# EAGLE design headset (EAGLE 6.4)
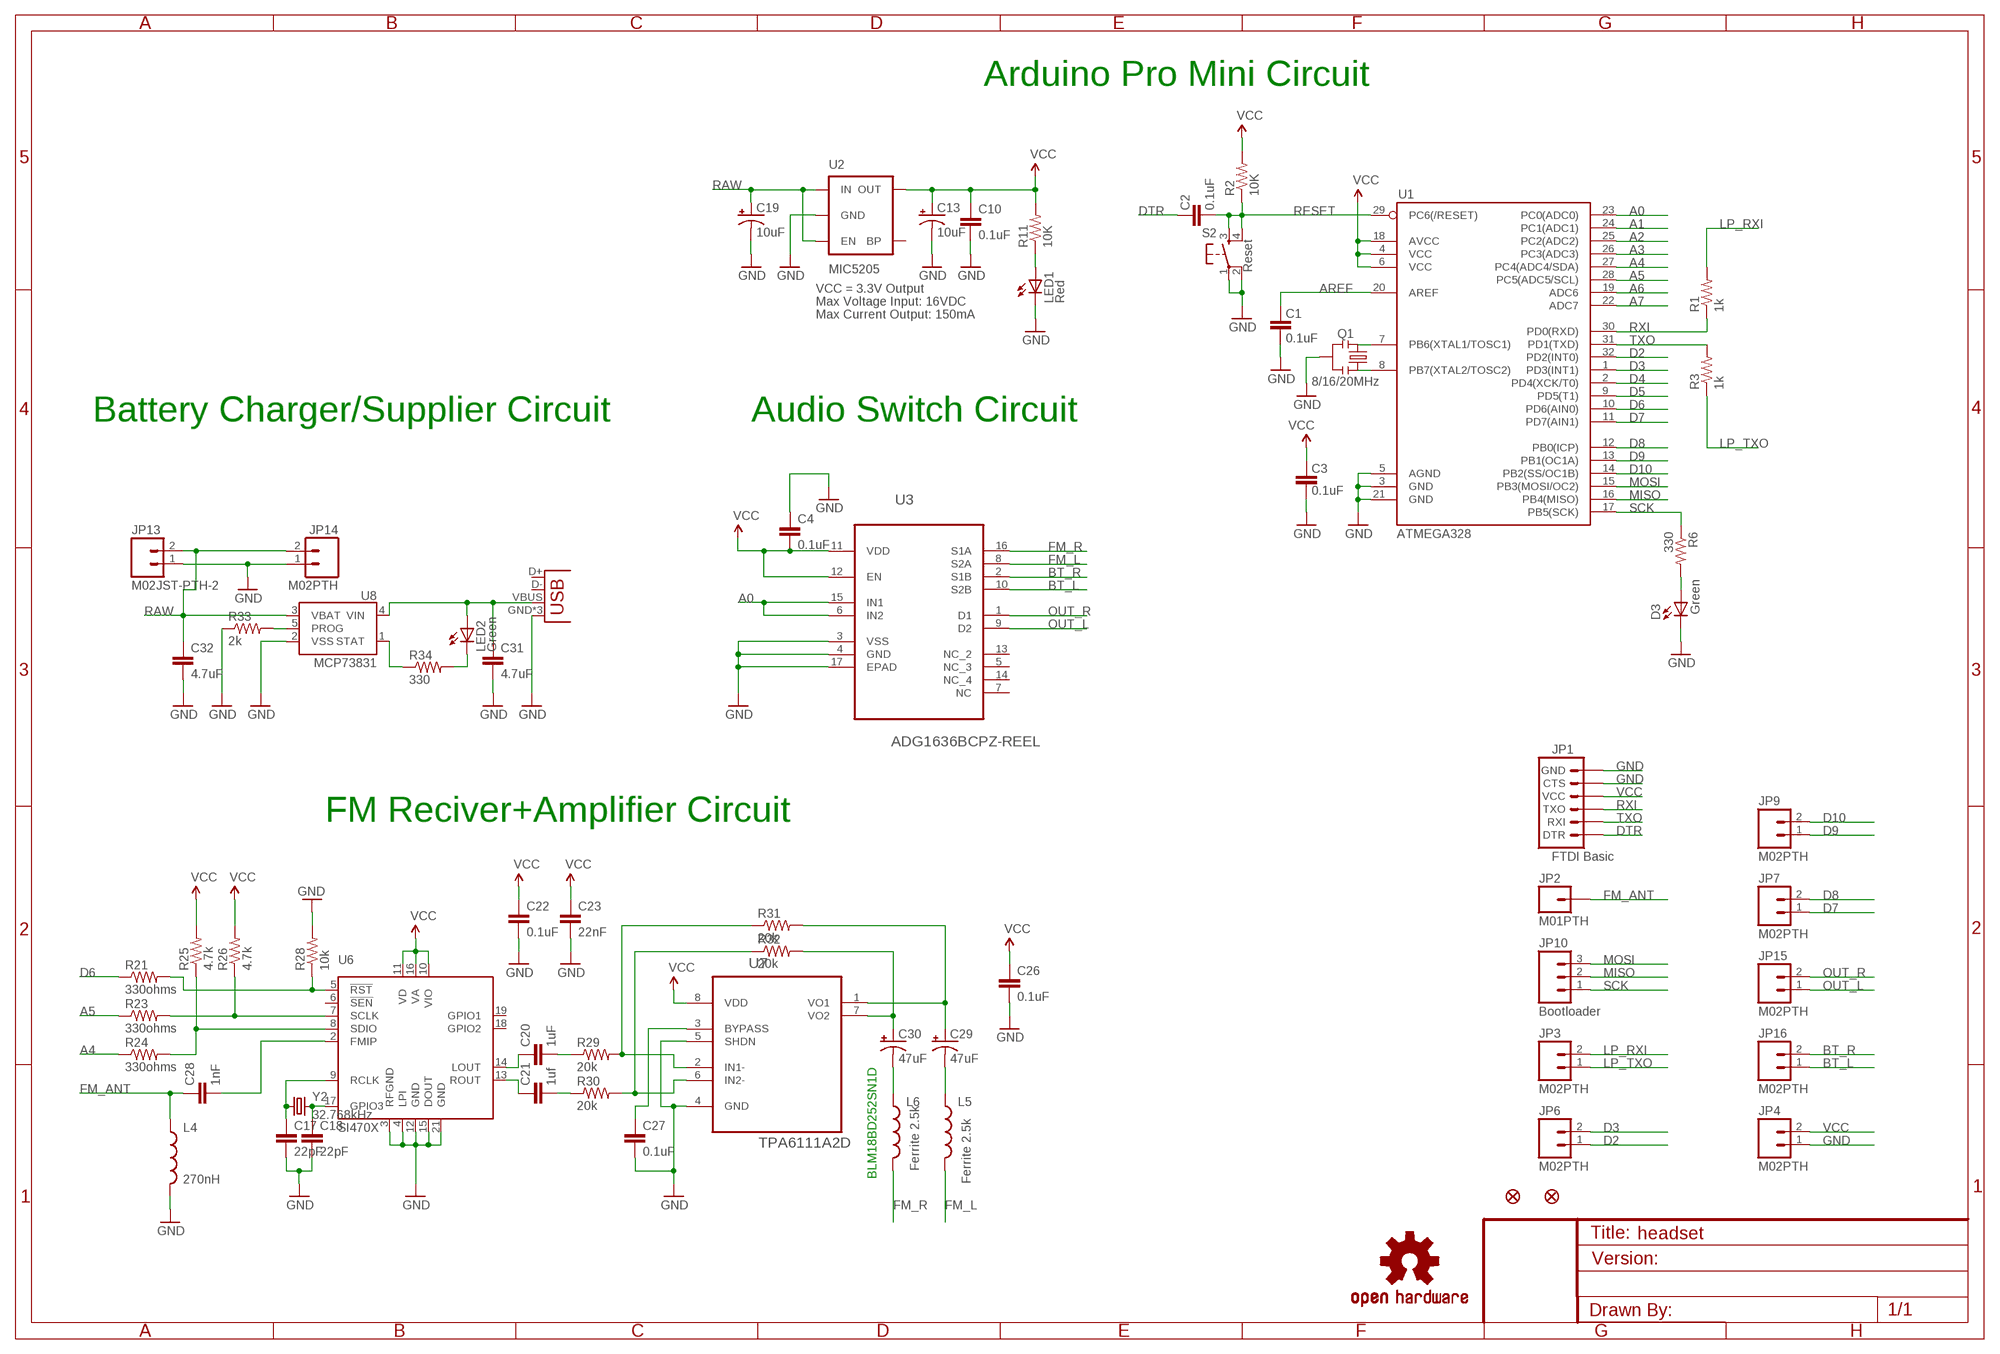
[diagram p0: schematic, sheet 1]

## Parts
C1  0.1uF  CAP0402-CAP  [0402-CAP]
C2  0.1uF  CAP0402-CAP  [0402-CAP]
C3  0.1uF  CAP0402-CAP  [0402-CAP]
C4  0.1uF  CAP0402-CAP  [0402-CAP]
C10  0.1uF  CAP0402-CAP  [0402-CAP]
C13  10uF  CAP_POL1206  [EIA3216]
C17  22pF  CAP0402-CAP  [0402-CAP]
C18  22pF  CAP0402-CAP  [0402-CAP]
C19  10uF  CAP_POL1206  [EIA3216]
C20  1uF  CAP0402-CAP  [0402-CAP]
C21  1uf  CAP0402-CAP  [0402-CAP]
C22  0.1uF  CAP0402-CAP  [0402-CAP]
C23  22nF  CAP0402-CAP  [0402-CAP]
C26  0.1uF  CAP0402-CAP  [0402-CAP]
C27  0.1uF  CAP0402-CAP  [0402-CAP]
C28  1nF  CAP0402-CAP  [0402-CAP]
C29  47uF  CAP_POL3528  [EIA3528]
C30  47uF  CAP_POL3528  [EIA3528]
C31  4.7uF  CAP0402-CAP  [0402-CAP]
C32  4.7uF  CAP0402-CAP  [0402-CAP]
D3  Green  LED0603  [LED-0603]
JP1  FTDI Basic  ARDUINO_SERIAL_PROGRAMPTH  [1X06]
JP2  M01PTH  [1X01]
JP3  M02PTH  [1X02]
JP4  M02PTH  [1X02]
JP5  FIDUCIALUFIDUCIAL  [MICRO-FIDUCIAL]
JP6  M02PTH  [1X02]
JP7  M02PTH  [1X02]
JP8  FIDUCIALUFIDUCIAL  [MICRO-FIDUCIAL]
JP9  M02PTH  [1X02]
JP10  Bootloader  M03PTH  [1X03]
JP12  USB-MICROB  [USB-MICROB]
JP13  M02JST-PTH-2  [JST-2-PTH]
JP14  M02PTH  [1X02]
JP15  M02PTH  [1X02]
JP16  M02PTH  [1X02]
L4  270nH  INDUCTOR0402  [C0402]
L5  Ferrite 2.5k  INDUCTOR0402  [C0402]
L6  Ferrite 2.5k  INDUCTOR0402  [C0402]
LED1  Red  LED0603  [LED-0603]
LED2  Green  LED-3MM-NO_SILK  [LED3MM-NS]
Q1  8/16/20MHz  RESONATORSMD  [RESONATOR-SMD]
R1  1k  RESISTOR0402-RES  [0402-RES]
R2  10K  RESISTOR0402-RES  [0402-RES]
R3  1k  RESISTOR0402-RES  [0402-RES]
R6  330  RESISTOR0402-RES  [0402-RES]
R11  10K  RESISTOR0402-RES  [0402-RES]
R21  330ohms  RESISTOR0402-RES  [0402-RES]
R23  330ohms  RESISTOR0402-RES  [0402-RES]
R24  330ohms  RESISTOR0402-RES  [0402-RES]
R25  4.7k  RESISTOR0402-RES  [0402-RES]
R26  4.7k  RESISTOR0402-RES  [0402-RES]
R28  10k  RESISTOR0402-RES  [0402-RES]
R29  20k  RESISTOR0402-RES  [0402-RES]
R30  20k  RESISTOR0402-RES  [0402-RES]
R31  20k  RESISTOR0402-RES  [0402-RES]
R32  20k  RESISTOR0402-RES  [0402-RES]
R33  2k  RESISTOR0402-RES  [0402-RES]
R34  330  RESISTOR0402-RES  [0402-RES]
S2  Reset  TAC_SWITCHSMD  [TACTILE_SWITCH_SMD]
U1  ATMEGA328  ATMEGA168  [TQFP32-08]
U2  MIC5205  V_REG_LDOSMD  [SOT23-5]
U3  ADG1636BCPZ-REEL  [QFN65P400X400X100-17N]
U6  SI470X  [SI470X]
U7  TPA6111A2D  [SOIC127P600X175-8N]
U8  MCP73831  [SOT23-5]
U$3  OSHW-LOGOS  [OSHW-LOGO-S]
Y2  32.768kHz  CRYSTAL32-SMD  [CRYSTAL-32KHZ-SMD]

## Nets
A0: U1.23(PC0(ADC0)) U3.6(IN2) U3.15(IN1)
A1: U1.24(PC1(ADC1))
A2: U1.25(PC2(ADC2))
A3: U1.26(PC3(ADC3))
A4: R24.1 U1.27(PC4(ADC4/SDA))
A5: R23.1 U1.28(PC5(ADC5/SCL))
A6: U1.19(ADC6)
A7: U1.22(ADC7)
AREF: C1.2 U1.20(AREF)
BT_L: JP16.1 U3.10(S2B)
BT_R: JP16.2 U3.2(S1B)
D2: JP6.1 U1.32(PD2(INT0))
D3: JP6.2 U1.1(PD3(INT1))
D4: U1.2(PD4(XCK/T0))
D5: U1.9(PD5(T1))
D6: R21.1 U1.10(PD6(AIN0))
D7: JP7.1 U1.11(PD7(AIN1))
D8: JP7.2 U1.12(PB0(ICP))
D9: JP9.1 U1.13(PB1(OC1A))
D10: JP9.2 U1.14(PB2(SS/OC1B))
DTR: C2.2 JP1.1(DTR)
FM_ANT: C28.1 JP2.1 L4.1
FM_L: L5.2 U3.8(S2A)
FM_R: L6.2 U3.16(S1A)
GND [vcc]: C1.1 C3.1 C4.1 C10.2 C13.C(-) C17.2 C18.2 C19.C(-) C22.2 C23.2 C26.2 C27.2 C31.2 C32.2 D3.C JP1.5(CTS) JP1.6(GND) JP4.1 JP12.GND JP12.MT1(GND) JP12.MT2(GND) JP13.1 JP14.1 L4.2 LED1.C Q1.2 R28.2 R33.1 S2.1 S2.2 U1.3(GND) U1.5(AGND) U1.21(GND) U2.2(GND) U3.3(VSS) U3.4(GND) U3.17(EPAD) U6.3(RFGND) U6.4(LPI) U6.12(GND) U6.15(DOUT) U6.21(GND) U7.4(GND) U7.5(SHDN) U8.2(VSS)
LP_RXI: JP3.2 R1.2
LP_TXO: JP3.1 R3.1
MISO: JP10.2 U1.16(PB4(MISO))
MOSI: JP10.3 U1.15(PB3(MOSI/OC2))
N$1: Q1.1 U1.8(PB7(XTAL2/TOSC2))
N$2: Q1.3 U1.7(PB6(XTAL1/TOSC1))
N$7: D3.A R6.2
N$12: R21.2 R28.1 U6.5(!RST)
N$14: R23.2 R26.1 U6.7(SCLK)
N$15: R24.2 R25.1 U6.8(SDIO)
N$30: C28.2 U6.2(FMIP)
N$31: C20.1 U6.14(LOUT)
N$32: C20.2 R29.1
N$33: R29.2 R31.1 U7.2(IN1-)
N$34: R30.2 R32.1 U7.6(IN2-)
N$35: C21.2 R30.1
N$36: C21.1 U6.13(ROUT)
N$37: C27.1 U7.3(BYPASS)
N$38: LED1.A R11.1
N$39: C29.A(+) R31.2 U7.1(VO1)
N$40: C30.A(+) R32.2 U7.7(VO2)
N$41: C17.1 U6.9(RCLK) Y2.X1
N$42: C18.1 U6.17(GPIO3) Y2.X2
N$43: C29.C(-) L5.1
N$44: C30.C(-) L6.1
N$45: C31.1 JP12.VBUS LED2.A U8.4(VIN)
N$46: LED2.K(C) R34.2
N$47: R34.1 U8.1(STAT)
N$48: R33.2 U8.5(PROG)
OUT_L: JP15.1 U3.9(D2)
OUT_R: JP15.2 U3.1(D1)
RAW [vcc]: C19.A(+) C32.1 JP13.2 JP14.2 U2.1(IN) U2.3(EN) U8.3(VBAT)
RESET: C2.1 R2.1 S2.3 S2.4 U1.29(PC6(/RESET))
RXI: JP1.3(TXO) R1.1 U1.30(PD0(RXD))
SCK: JP10.1 R6.1 U1.17(PB5(SCK))
TXO: JP1.2(RXI) R3.2 U1.31(PD1(TXD))
VCC: C3.2 C4.2 C10.1 C13.A(+) C22.1 C23.1 C26.1 JP1.4(VCC) JP4.2 R2.2 R11.2 R25.2 R26.2 U1.4(VCC) U1.6(VCC) U1.18(AVCC) U2.5(OUT) U3.11(VDD) U3.12(EN) U6.10(VIO) U6.11(VD) U6.16(VA) U7.8(VDD)
Unconnected: JP12.D+ JP12.D- U2.4(BP) U3.5(NC_3) U3.7(NC) U3.13(NC_2) U3.14(NC_4) U6.6(!SEN) U6.18(GPIO2) U6.19(GPIO1)

## Notes on the sheet
- Arduino Pro Mini Circuit
- VCC = 3.3V Output
- Max Voltage Input: 16VDC
- Max Current Output: 150mA
- Battery Charger/Supplier Circuit | Audio Switch Circuit
- FM Reciver+Amplifier Circuit
- BLM18BD252SN1D

## Library data of the parts
C1-C3 C10 = SparkFun:CAP: Capacitor Standard 0603 ceramic capacitor, and 0.1" leaded capacitor.
C4 C17 C18 C20-C23 C26-C28 C31 C32 = SparkFun-Passives:CAP: Capacitor Standard 0603 ceramic capacitor, and 0.1" leaded capacitor.
C13 C19 = SparkFun:CAP_POL: Capacitor Polarized These are standard SMD and PTH capacitors. Normally 10uF, 47uF, and 100uF in electrolytic and tantalum varieties. Always verify the external diameter of the through hole cap, it varies with capacity, voltage, and manufacturer. The EIA devices should be standard.
C29 C30 = SparkFun-Passives:CAP_POL: Capacitor Polarized These are standard SMD and PTH capacitors. Normally 10uF, 47uF, and 100uF in electrolytic and tantalum varieties. Always verify the external diameter of the through hole cap, it varies with capacity, voltage, and manufacturer. The EIA devices should be standard.
D3 LED1 = SparkFun:LED: LEDs Standard schematic elements and footprints for 5mm, 3mm, 1206, and 0603 sized LEDs. 5mm - Spark Fun Electronics SKU : COM-00529 (and others)
JP1 = SparkFun:ARDUINO_SERIAL_PROGRAM
JP2 = SparkFun-Connectors:M01: Header 1 Standard 1-pin 0.1" header. Use with straight break away headers (SKU : PRT-00116), right angle break away headers (PRT-00553), swiss pins (PRT-00743), machine pins (PRT-00117), and female headers (PRT-00115).
JP3 JP4 JP6 JP7 JP9 JP13-JP16 = SparkFun-Connectors:M02: Standard 2-pin 0.1" header. Use with - straight break away headers ( PRT-00116) - right angle break away headers (PRT-00553) - swiss pins (PRT-00743) - machine pins (PRT-00117) - female headers (PRT-00115) Molex polarized connector foot print use with: PRT-08233 with associated crimp pins and housings. 2.54_SCREWTERM for use with PRT-10571. 3.5mm Screw Terminal footprints for PRT-08084 5mm Screw Terminal footprints for use with PRT-08433
JP5 JP8 = SparkFun:FIDUCIAL: Fiducial Alignment Points Various fiducial points for machine vision alignment.
JP10 = SparkFun-Connectors:M03: Header 3 Standard 3-pin 0.1" header. Use with straight break away headers (SKU : PRT-00116), right angle break away headers (PRT-00553), swiss pins (PRT-00743), machine pins (PRT-00117), and female headers (PRT-00115). Molex polarized connector foot print use with SKU : PRT-08232 with associated crimp pins and housings.
JP12 = SparkFun-Connectors:USB: USB Connectors USB-B-PTH is fully proven SKU : PRT-00139/CONN-08278 USB-miniB is fully proven SKU : PRT-00587 USB-A-PCB is untested. USB-A-H is throughly reviewed, but untested. Spark Fun Electronics SKU : PRT-00437 USB-B-SMT is throughly reviewed, but untested. Needs silkscreen touching up. USB-A-S has not been used/tested USB-MB-H has not been used/tested USB-MICROB has been used. CONN-09505; PROD_ID: CONN-09505
L4-L6 = SparkFun-Passives:INDUCTOR: Inductors Basic Inductor/Choke - 0603 and 1206. Footprints are not proven and vary greatly between part numbers. SRN6045- 33uH, 20% 1.4A
LED2 = SparkFun-LED:LED: LEDs Standard schematic elements and footprints for 5mm, 3mm, 1206, and 0603 sized LEDs. 5mm - Spark Fun Electronics SKU : COM-00529 (and others)
Q1 = SparkFun:RESONATOR: Resonator Small SMD resonator. This is the itty bitty 10/20MHz resonators with built in caps. CSTCE10M0G55 and CSTCE20M0V53. Footprint has been reviewed closely but hasn't been tested yet.
R1 R3 R21 R23-R26 R28-R34 = SparkFun-Passives:RESISTOR: Resistor Basic schematic elements and footprints for 0603, 1206, and PTH resistors.
R2 R6 R11 = SparkFun:RESISTOR: Resistor Basic schematic elements and footprints for 0603, 1206, and PTH resistors.
S2 = SparkFun:TAC_SWITCH: Momentary Switch Button commonly used for reset or general input. Spark Fun Electronics SKU : COM-00097
U1 = SparkFun:ATMEGA168
U2 = SparkFun:V_REG_LDO: Voltage Regulator LDO Standard 150mA LDO voltage regulator in SOT-23 layout. Micrel part MIC5205. BP (by-pass) pin is used to lower output noise with 470pF cap.
U3 = Analog Devices_By_element14_Batch_1:ADG1636BCPZ-REEL: 1 Ù Typical On Resistance, ±5 V, +12 V, +5 V, and +3.3 V Dual SPDT Switches; MPN: ADG1636BCPZ-REEL; OC_FARNELL: -; OC_NEWARK: 71P7820; PACKAGE: QFN-16; SUPPLIER: Analog Devices
U6 = SparkFun-RF:SI470X: FM receiver IC. Tested with Si4703. You really only need SEN, RST, SCLK, and SDIO to get a full FM radio working. Antenna comes from headphone jack. See BOB-10344.
U7 = Texas Instruments_By_element14_Batch_1:TPA6111A2D: AUDIO POWER AMPLIFIER; MPN: TPA6111A2D; OC_FARNELL: 8456593; OC_NEWARK: 38K8607; PACKAGE: SOIC-8; SUPPLIER: TI
U8 = SparkFun-PowerIC:MCP73831: Miniature single cell, fully integrated Li-Ion, Li-polymer charge management controller http://ww1.microchip.com/downloads/en/DeviceDoc/21984a.pdf IC-09995; PROD_ID: IC-09995
U$3 = SparkFun:OSHW-LOGO: Open Source Hardware Logo This logo indicates the piece of hardware it is found on incorporates a OSHW license and/or adheres to the definition of open source hardware found here: http://freedomdefined.org/OSHW
Y2 = SparkFun-FreqCtrl:CRYSTAL: Various standard crystals. Proven footprints. Spark Fun Electronics SKU : COM-00534

## Net classes
0 default: width 0.203 mm
1 vcc: width 0.254 mm

## Board
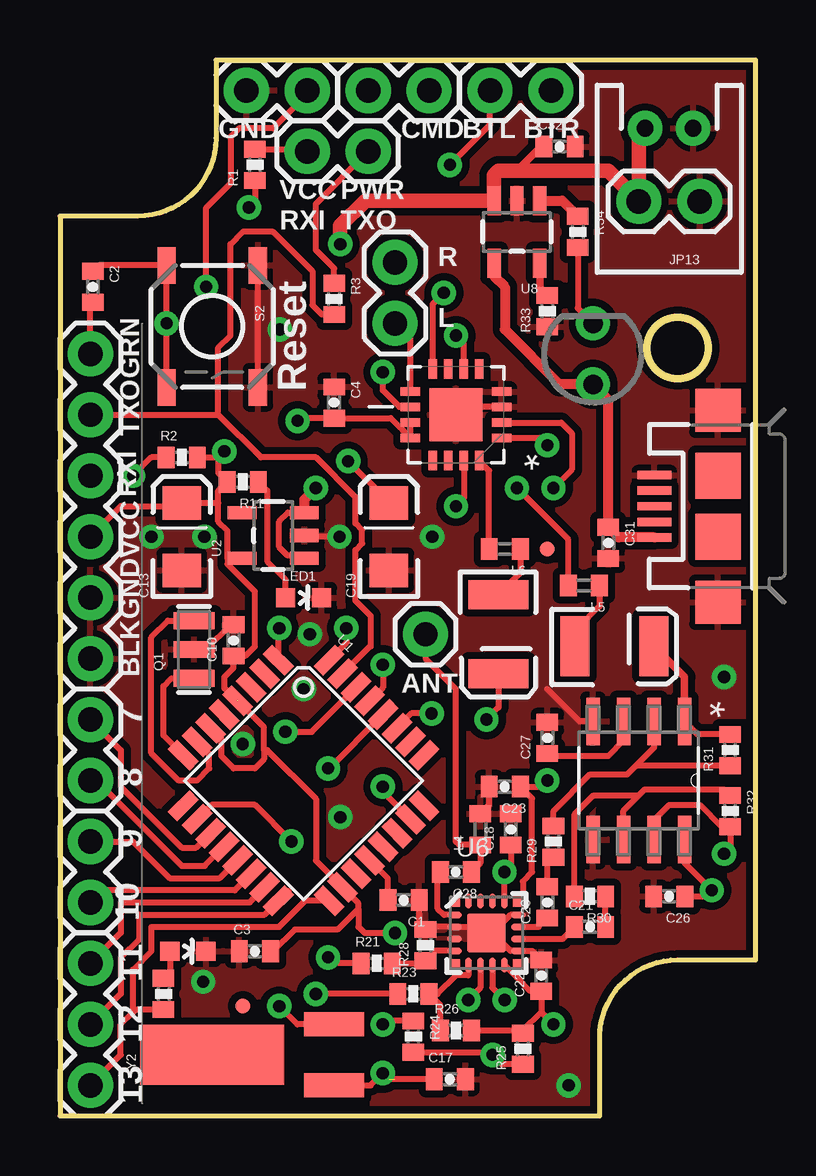
[diagram p1: board, top side]
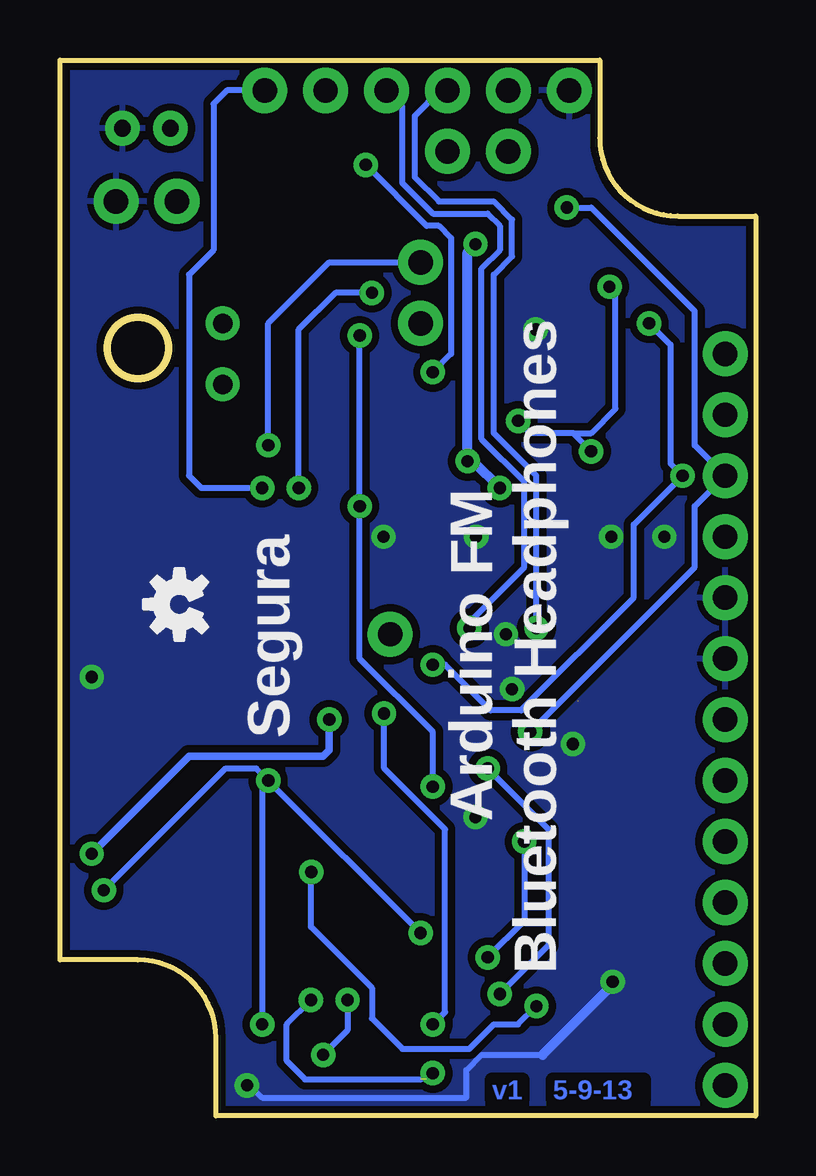
[diagram p2: board, bottom side, seen from below]

Size 29.01 x 43.99 mm. Coordinates in mm from the lower left corner, seen from the top.
Outline: 6.5,40.74 arc-90 3.25,37.49 0,37.49 0,0 22.5,0 22.5,3.25 arc-90 25.76,6.5 29.01,6.5 29.01,43.99 6.5,43.99 6.5,40.74
Outline: circle at 25.76,31.99 radius 1.27
Copper layers (1*16): Top 0.035mm / dielectric 1.5mm / Bottom 0.035mm
Design rules "default": minimum track width 8mil, minimum drill 20mil, track to track 8mil, track to pad 8mil, pad to pad 8mil, via to via 8mil, smd to smd 8mil, copper to edge 8mil, drill to drill 8mil, minimum pad ring 12mil, minimum via ring 10mil, stop-mask expansion 4mil, vias tented up to drill 20mil, thermal gap 10mil

### Footprints (pad centres in the part's own frame; a part is rotated, then mirrored left to right if it is on the bottom)
0402-CAP = smd 0.7 x 0.9: 1 -0.65,0; 2 0.65,0
EIA3216 = smd 1.4 x 1.6: A 1.4,0; C -1.4,0
EIA3528 = smd 1.2 x 2.5: A 1.65,0; C -1.65,0
LED-0603 = smd 0.8 x 0.8: A 0,-0.75; C 0,0.75
1X06 = drill 1.016 pad 1.88: 1 0,0; 2 2.54,0; 3 5.08,0; 4 7.62,0; 5 10.16,0; 6 12.7,0
1X01 = drill 1.016 pad 1.88: 1 0,0
1X02 = drill 1.016 pad 1.88: 1 0,0; 2 2.54,0
MICRO-FIDUCIAL = smd 0.635 x 0.635: 1 0,0
1X03 = drill 1.016 pad 1.88: 1 0,0; 2 2.54,0; 3 5.08,0
USB-MICROB = smd 0.35 x 1.4: D+ 0,2.65; D- -0.65,2.65; GND 1.3,2.65; ID 0.65,2.65; VBUS -1.3,2.65 | smd 1.8 x 1.9: MT1 -4,0; MT2 4,0 | smd 1.9 x 1.9: P$1 -1.27,0; P$2 1.27,0
JST-2-PTH = drill 0.7 pad 1.448: 1 -1,0; 2 1,0
C0402 = smd 0.7 x 0.9: 1 -0.65,0; 2 0.65,0
LED3MM-NS = drill 0.813: A -1.27,0; K 1.27,0
RESONATOR-SMD = smd 0.7 x 1.7: 1 -1.2,0; 2 0,0; 3 1.2,0
0402-RES = smd 0.7 x 0.9: 1 -0.65,0; 2 0.65,0
TACTILE_SWITCH_SMD = smd 1.524 x 0.762: 1 -2.54,1.905; 2 2.54,1.905; 3 -2.54,-1.905; 4 2.54,-1.905
TQFP32-08 = smd 1.27 x 0.559: 1 -4.293,2.8; 2 -4.293,2; 3 -4.293,1.2; 4 -4.293,0.4; 5 -4.293,-0.4; 6 -4.293,-1.2; 7 -4.293,-2; 8 -4.293,-2.8; 17 4.293,-2.8; 18 4.293,-2; 19 4.293,-1.2; 20 4.293,-0.4; 21 4.293,0.4; 22 4.293,1.2; 23 4.293,2; 24 4.293,2.8 | smd 0.559 x 1.27: 9 -2.8,-4.293; 10 -2,-4.293; 11 -1.2,-4.293; 12 -0.4,-4.293; 13 0.4,-4.293; 14 1.2,-4.293; 15 2,-4.293; 16 2.8,-4.293; 25 2.8,4.293; 26 2,4.293; 27 1.2,4.293; 28 0.4,4.293; 29 -0.4,4.293; 30 -1.2,4.293; 31 -2,4.293; 32 -2.8,4.293
SOT23-5 = smd 0.55 x 1.2: 1 -0.95,-1.3; 2 0,-1.3; 3 0.95,-1.3; 4 0.95,1.3; 5 -0.95,1.3
QFN65P400X400X100-17N = smd 0.813 x 0.356: 1 -1.905,0.965; 2 -1.905,0.33; 3 -1.905,-0.33; 4 -1.905,-0.965; 9 1.905,-0.965; 10 1.905,-0.33; 11 1.905,0.33; 12 1.905,0.965 | smd 0.356 x 0.813: 5 -0.965,-1.905; 6 -0.33,-1.905; 7 0.33,-1.905; 8 0.965,-1.905; 13 0.965,1.905; 14 0.33,1.905; 15 -0.33,1.905; 16 -0.965,1.905 | smd 2.21 x 2.21: 17 0,0
SI470X = smd 0.34 x 0.34: 1 -1.275,1.265; 6 -1.265,-1.265; 11 1.265,-1.265; 16 1.265,1.265 | smd 0.61 x 0.28: 2 -1.335,0.75; 3 -1.335,0.25; 4 -1.335,-0.25; 5 -1.335,-0.75; 12 1.335,-0.75; 13 1.335,-0.25; 14 1.335,0.25; 15 1.335,0.75 | smd 0.28 x 0.61: 7 -0.75,-1.335; 8 -0.25,-1.335; 9 0.25,-1.335; 10 0.75,-1.335; 17 0.75,1.335; 18 0.25,1.335; 19 -0.25,1.335; 20 -0.75,1.335 | smd 1.6 x 1.6: 21 0,0
SOIC127P600X175-8N = smd 1.981 x 0.559: 1 -2.464,1.905; 2 -2.464,0.635; 3 -2.464,-0.635; 4 -2.464,-1.905; 5 2.464,-1.905; 6 2.464,-0.635; 7 2.464,0.635; 8 2.464,1.905
CRYSTAL-32KHZ-SMD = smd 2.5 x 6: SHEILD 0,5.08 | smd 1 x 2.5: X1 -1.27,0; X2 1.27,0

### Placement (x,y rotation side)
C1  14.33,8.99 180 top
C2  1.37,34.54 270 top
C3  8.13,6.86 0 top
C4  11.43,29.72 270 top
C10  7.24,19.81 90 top
C13  5.08,24.13 90 top
C17  16.26,1.52 0 top
C18  18.8,11.94 90 top
C19  13.72,24.13 90 top
C20  20.32,8.89 90 top
C21  22.1,7.87 0 top
C22  20.07,5.84 90 top
C23  18.54,13.72 180 top
C26  25.4,9.14 180 top
C27  20.32,15.75 90 top
C28  16.51,10.16 180 top
C29  23.11,19.56 0 top
C30  18.29,20.07 270 top
C31  22.86,23.88 270 top
C32  20.83,40.39 0 top
D3  5.33,6.86 270 top
JP1  1.27,31.75 270 top
JP2  15.24,20.07 0 top
JP3  12.85,40.18 180 top
JP4  7.77,42.72 0 top
JP5  20.32,23.62 0 top
JP6  15.39,42.72 180 top
JP7  1.27,16.51 270 top
JP8  7.62,4.57 0 top
JP9  1.27,11.43 270 top
JP10  1.27,1.27 90 top
JP12  27.43,25.4 90 top
JP13  25.4,41.15 180 top
JP14  26.67,38.1 180 top
JP15  13.97,33.02 90 top
JP16  17.93,42.72 0 top
L4  17.53,11.94 90 top
L5  21.84,22.1 180 top
L6  18.54,23.62 180 top
LED1  10.16,21.59 270 top
LED2  22.23,31.75 90 top
Q1  5.59,19.43 90 top
R1  8.13,39.62 90 top
R2  5.08,27.43 0 top
R3  11.43,34.04 270 top
R6  4.32,5.08 90 top
R11  7.62,26.42 180 top
R21  13.21,6.35 0 top
R23  14.73,5.08 0 top
R24  14.73,3.3 270 top
R25  19.3,2.79 90 top
R26  16.51,3.56 0 top
R28  15.24,7.11 90 top
R29  20.57,11.43 90 top
R30  22.1,9.14 180 top
R31  27.94,15.24 90 top
R32  27.94,12.7 270 top
R33  20.32,33.53 90 top
R34  21.59,36.83 270 top
S2  6.35,32.89 270 top
U1  10.16,13.97 315 top
U2  8.89,24.18 90 top
U3  16.51,29.21 180 top
U6  17.78,7.62 0 top
U7  24.13,13.97 270 top
U8  19.05,36.83 180 top
U$3  24.03,21.31 90 bottom
Y2  11.43,2.54 90 top

### Tracks (layer width: path | path; a pad name or v marks a point on that pad's centre or on a via)
A0  (via drill 0.51)
  Top 0.254: U3.15 16.84,25.73 v16.51,25.4 | U3.6 16.84,32.18 v16.51,32.51 | v13.46,13.72 13.46,13.5 U1.23
  Bottom 0.254: v16.51,32.51 v16.51,25.4 16.51,19.05 13.46,16 v13.46,13.72
A4  (via drill 0.51)
  Top 0.254: R24.1 13.6,3.95 v13.46,3.81 | v15.49,16.76 14.65,16.76 U1.27
  Bottom 0.254: v15.49,16.76 15.49,14.48 12.95,11.94 12.95,4.32 v13.46,3.81
A5  (via drill 0.51)
  Top 0.254: R23.1 v10.67,5.08 | v11.18,14.48 11.18,14.42 U1.28
  Bottom 0.254: v10.67,5.08 8.64,7.11 8.64,11.94 v11.18,14.48
AREF
  Top 0.254: C1.2 13.68,9.89 U1.20
BT_L  (via drill 0.51)
  Top 0.254: v16.26,39.62 17.93,41.3 JP16.1 | U3.10 14.15,29.54 13.46,30.23 v13.46,30.99
  Bottom 0.254: v13.46,30.99 12.7,31.75 12.7,36.58 13.21,37.08 13.72,37.08 v16.26,39.62
BT_R  (via drill 0.51)
  Top 0.254: U3.2 20.9,28.88 21.34,28.45 21.34,26.92 v20.57,26.16
  Bottom 0.254: v20.57,26.16 23.11,26.16 23.62,26.67 23.62,35.05 22.61,36.07 22.61,42.16 22.05,42.72 JP16.2
D2  (via drill 0.51)
  Top 0.254: v11.94,20.32 11.94,19.71 U1.32
  Bottom 0.254: v11.94,20.32 11.94,20.57 9.65,22.86 9.65,26.42 11.43,28.19 11.43,35.31 10.67,36.07 10.67,37.08 11.18,37.59 13.46,37.59 14.73,38.86 14.73,42.06 JP6.1
D3  (via drill 0.51)
  Top 0.254: U1.1 9.11,20.28 v9.14,20.32
  Bottom 0.254: v9.14,20.32 9.14,26.67 10.92,28.45 10.92,35.05 10.16,35.81 10.16,37.34 10.92,38.1 13.21,38.1 14.22,39.12 14.22,41.66 13.16,42.72 JP6.2
D6  (via drill 0.51)
  Top 0.254: v9.65,11.43 8.13,12.95 6.32,12.95 U1.10 | R21.1 11.43,6.35 v11.18,6.6
  Bottom 0.254: v9.65,11.43 9.65,8.13 v11.18,6.6
D7
  Top 0.254: U1.11 5.67,11.18 5.08,11.18 2.54,13.72 2.54,15.24 JP7.1
D8
  Top 0.254: 6.55,10.92 U1.12 6.04,10.41 5.08,10.41 1.52,13.97 JP7.2
D9
  Top 0.254: U1.13 6.66,9.91 4.57,9.91 3.05,11.43 JP9.1
D10
  Top 0.254: U1.14 7.29,9.4 1.78,9.4 JP9.2
DTR
  Top 0.254: JP1.1 1.27,33.79 C2.2
FM_ANT
  Top 0.254: C28.1 17.53,10.53 L4.1 16.65,11.29 16.51,11.43 16.51,17.78 15.24,19.05 JP2.1
FM_L  (via drill 0.51)
  Top 0.254: L5.2 21.19,24.02 v19.05,26.16 | U3.8 15.54,33.83 v16,34.29
  Bottom 0.254: v19.05,26.16 19.05,32.77 17.53,34.29 v16,34.29
FM_R
  Top 0.254: L6.2 17.89,26.89 U3.16
GND  (via drill 0.51)
  Top 0.254: C10.2 7.13,20.46 6.1,19.43 Q1.2 | v11.66,24.13 10.16,24.13 | S2.2 S2.1 | C1.1 14.98,8.03 R28.2 15.35,7.87 U6.3 17.53,7.87 U6.21 18.03,7.62 | C23.2 17.89,12.95 L4.2 | U3.3 16.84,29.54 U3.17 | 18.03,7.62 18.78,8.37 U6.15 | 18.03,7.62 18.78,6.87 U6.12 19.69,6.87 C22.2 | U7.4 21.67,16.43 20.32,17.78
  Bottom 0.254: v21.21,1.27 21.08,1.27 20.57,0.76 12.06,0.76 12.06,1.91 11.43,2.54 8.89,2.54
  Bottom 0.406: v5.97,5.59 5.97,5.46 8.89,2.54
  other vias: 11.68,12.45 27.69,18.29 10.41,20.07 7.62,15.49 15.52,24.13 10.16,17.78 3.81,24.13 6.02,24.13 9.17,32.77
  pour Top (isolate 0.305): 0,43.99 29.01,43.99 29.01,0 0,0
  pour Bottom (isolate 0.305): 0,43.99 29.01,43.99 29.01,0 0,0
LP_RXI
  Top 0.254: R1.2 10.22,40.27 JP3.2
LP_TXO
  Top 0.254: JP3.1 10.67,38 10.67,36.07 11.43,35.31 R3.1
MISO
  Top 0.254: 9.53,9.14 9.53,9.38 U1.16 8.53,8.38 3.3,8.38 3.3,7.37 2.54,6.6 2.54,5.08 JP10.2
MOSI
  Top 0.254: JP10.3 2.54,7.62 2.54,8.89 7.91,8.89 U1.15
N$1
  Top 0.254: Q1.1 4.64,18.23 4.32,17.91 4.32,15.85 | 4.32,15.85 | 4.32,15.85 U1.8
N$2
  Top 0.254: Q1.3 4.5,20.63 3.81,19.94 3.81,15.11 4.95,13.97 5.71,13.97 6.22,14.48 6.22,15.08 U1.7
N$7
  Top 0.254: D3.A 4.58,6 R6.2
N$12
  Top 0.254: U6.5 15.65,6.87 R28.1 15.13,6.35 R21.2
N$14
  Top 0.254: U6.7 17.03,5.85 16.52,5.85 15.75,5.08 R23.2 15.86,4.6 R26.1
N$15  (via drill 0.51)
  Top 0.254: U6.8 17.53,5.34 v17.02,4.83 | R25.1 18.43,2.14 v18.03,2.54 17.92,2.65 R24.2
  Bottom 0.254: v17.02,4.83 17.02,3.56 v18.03,2.54
N$30
  Top 0.254: 15.76,10.06 C28.2 15.75,10.05 15.75,8.64 16.01,8.37 U6.2
N$31
  Top 0.254: U6.14 19.95,7.87 C20.1
N$32
  Top 0.254: C20.2 20.32,10.53 R29.1
N$33
  Top 0.254: R31.1 24.02,14.59 | R29.2 20.57,12.7 22.1,14.22 23.65,14.22 24.02,14.59 | U7.2 24.77,15.34 24.02,14.59
N$34
  Top 0.254: 24.13,13.35 22.24,13.35 21.45,12.56 R30.2 | U7.6 23.5,12.71 24.13,13.35 | 24.13,13.35 24.38,13.6 27.69,13.6 R32.1
N$35
  Top 0.254: C21.2 R30.1
N$36
  Top 0.254: U6.13 20.97,7.37 21.45,7.85 C21.1
N$37
  Top 0.254: U7.3 23.5,15.62 22.86,14.99 20.43,14.99 C27.1
N$38
  Top 0.254: LED1.A 9.4,21.59 9.4,22.35 8.64,23.11 8.64,26.05 R11.1
N$39
  Top 0.254: R31.2 26.58,15.89 U7.1
  Top 0.305: U7.1 26.04,18.29 C29.A
N$40  (via drill 0.51)
  Top 0.254: U7.7 24.77,12.32 25.4,12.95 26.67,12.95 27.57,12.05 R32.2 27.94,10.92 v27.69,10.92 | C30.A 18.29,17.02 v17.78,16.51
  Bottom 0.305: v17.78,16.51 17.78,15.24 18.03,14.99 23.62,14.99 v27.69,10.92
N$41  (via drill 0.51)  (1 unrouted)
  Top 0.254: U6.9 18.03,5.34 v18.54,4.83 | C17.1 13.72,1.52 v13.46,1.78 12.95,1.27 Y2.X1
  Bottom 0.254: 13.97,1.52 18.8,1.52 19.56,2.29 19.56,3.81 v18.54,4.83
N$42  (via drill 0.51)
  Top 0.254: U6.17 v18.53,10.16 18.8,10.43 C18.1 | Y2.X2 9.91,3.81 v9.14,4.57
  Bottom 0.254: v9.14,4.57 9.91,3.81 10.92,3.81 11.94,2.79 14.73,2.79 16,4.06 16,5.33 18.54,7.87 18.54,10.15 v18.53,10.16
N$43
  Top 0.254: L5.1 22.49,21.22 21.59,20.32 21.59,19.68 C29.C
N$44
  Top 0.254: L6.1 19.19,22.62 C30.C
N$45
  Top 0.406: JP12.VBUS 23.29,24.1 C31.1 22.86,29.84 LED2.A 20.83,30.48 18.54,32.77 18.54,34.54 18.1,34.99 U8.4
N$46
  Top 0.254: R34.2 21.59,33.66 LED2.K
N$47
  Top 0.406: U8.1 20.94,38.13 R34.1
N$48
  Top 0.305: U8.5 20,34.5 R33.2
OUT_L
  Top 0.254: U3.9 14.61,32.38 JP15.1
OUT_R  (via drill 0.51)
  Top 0.254: U3.1 20.02,28.25 v20.32,27.94
  Bottom 0.254: v20.32,27.94 20.32,33.02 17.78,35.56 JP15.2
RAW  (via drill 0.51)
  Top 0.254: U2.3 9.51,25.13 9.14,24.77 9.14,23.7 9.5,23.34 10.08,23.34 U2.1 | C19.A 13.72,25.83 13.46,25.83 v12.01,27.28
  Top 0.305: C32.1 20.18,40.5 19.05,39.37
  Top 0.406: U2.3 10.19,25.68 v10.67,26.16
  Top 0.61: JP13.2 24.13,41.15 JP14.2 22.86,39.37 19.05,39.37 18.29,39.37 18.1,39.18 U8.3 12.73,38.13 11.68,37.08 v11.68,36.32
  Bottom 0.406: v11.68,36.32 12.01,35.99 v12.01,27.28 11.79,27.28 v10.67,26.16
RESET  (via drill 0.51)
  Top 0.254: S2.4 v4.45,33.02 S2.3 1.61,35.43 C2.1 | v13.46,18.8 13.46,17.84 U1.29 | R2.1 3.81,27.43 v3.05,26.67
  Bottom 0.254: v4.45,33.02 3.56,32.13 3.56,27.18 v3.05,26.67 5.08,24.64 5.08,21.59 9.78,16.89 11.05,16.89 12.95,18.8 v13.46,18.8
RXI  (via drill 0.51)
  Top 0.254: v9.4,16 10.49,16 U1.30 | R1.1 8.13,38.1 v7.87,37.85
  Bottom 0.254: v9.4,16 2.54,22.86 2.54,25.4 JP1.3 2.54,27.94 2.54,33.53 6.86,37.85 v7.87,37.85
SCK
  Top 0.254: JP10.1 2.54,2.54 2.54,3.81 3.05,4.32 | 3.05,4.32 3.05,6.1 3.81,6.86 3.81,7.87 9.14,7.87 10.22,8.96 U1.17 | R6.1 3.16,4.43 3.05,4.32
TXO
  Top 0.254: 6.6,29.21 8.38,27.43 10.67,27.43 12.32,25.78 12.32,24.69 12.6,24.41 12.6,23.85 12.32,23.57 12.32,21.46 12.95,20.83 12.95,19.56 12.92,19.56 U1.31 | 6.6,29.21 6.6,32 7.11,32.51 7.11,36.32 7.62,36.83 8.89,36.83 10.53,35.19 10.53,33.78 10.92,33.39 R3.2 | JP1.2 6.6,29.21
VCC  (via drill 0.51)  (1 unrouted)
  Top 0.254: 6.6,25.53 C13.A 4.95,25.4 2.54,25.4 JP1.4 | 6.6,25.53 6.6,24.75 6.99,24.37 6.99,23.23 | 6.99,23.23 U2.5 | 8.51,15.24 8.51,16.19 U1.4 | 8.51,15.24 8.64,15.24 10.67,13.21 10.67,10.63 U1.18 12.45,8.86 12.45,8.64 | 8.51,15.24 8.51,14.86 8.13,14.48 7.24,14.48 6.73,14.99 6.73,15.7 U1.6 | U3.12 U3.11 | 12.45,8.64 11.57,7.76 9.79,7.76 8.89,6.86 C3.2 | 19.05,5.77 U6.10 | U6.11 19.05,5.77 | 19.05,5.77 19.62,5.19 C22.1 20.07,4.32 | 6.99,23.23 6.99,22.99 8.13,21.84 8.13,19.56 7.75,19.18 7.24,19.18 7.22,19.16 C10.1 7.24,18.67 6.86,18.29 6.86,17.81 7.38,17.29 | R2.2 6.6,27.43 | 6.6,27.43 v6.86,27.69 | 20.07,4.32 19.3,3.56 R25.2 19.19,3.56 R26.2 | 20.07,4.32 v20.57,3.81 | U7.8 26.04,10.54 v27.18,9.4 26.92,9.14 C26.1 | 14.29,28.56 U3.12 | 6.6,27.43 6.6,26.78 R11.2 6.6,26.05 6.6,25.53 | v20.32,13.97 20.07,13.72 C23.1 19.68,13.22 19.68,10.16 19.3,9.77 19.3,9.14 U6.16 | 12.45,8.64 12.45,7.87 12.7,7.62 v13.97,7.62 | v6.1,34.54 6.1,37.85 7.11,38.86 7.11,40.79 7.47,41.15 8.89,41.15 10.31,42.57 JP4.2 | v9.91,28.96 10.02,29.07 C4.2 13.78,29.07 U3.12
  Bottom 0.254: v20.57,3.81 20.57,13.72 v20.32,13.97 | v6.1,34.54 5.84,34.29 5.84,29.46 6.86,28.45 7.62,28.45 | 7.62,28.45 v6.86,27.69 | v27.18,9.4 22.1,14.48 20.83,14.48 v20.32,13.97 | v13.97,7.62 v20.32,13.97 | 7.62,28.45 9.4,28.45 v9.91,28.96

### Text on the board
Bottom: 5-9-13 | v1
tPlace: GND | CMD | BTL | BTR | VCC | PWR | RXI | TXO | R | L | GRN | Reset | TXO | RXI | VCC | GND | BLK | ANT | 7 | 8 | 9 | 10 | 11 | 12 | 13
bPlace: Arduino FM / Bluetooth Headphones | Segura
tValues: Valid combinations: | 168V / 3.3V Reg / 8MHz | 168 / 5V Reg / 16MHz | 168 / 5V Reg / 20MHz | Mark back accordingly | Arduino Pro Mini